# Altium schematic sheet ISO.SchDoc
size A4; SheetNumber: 4; SheetTotal: 6
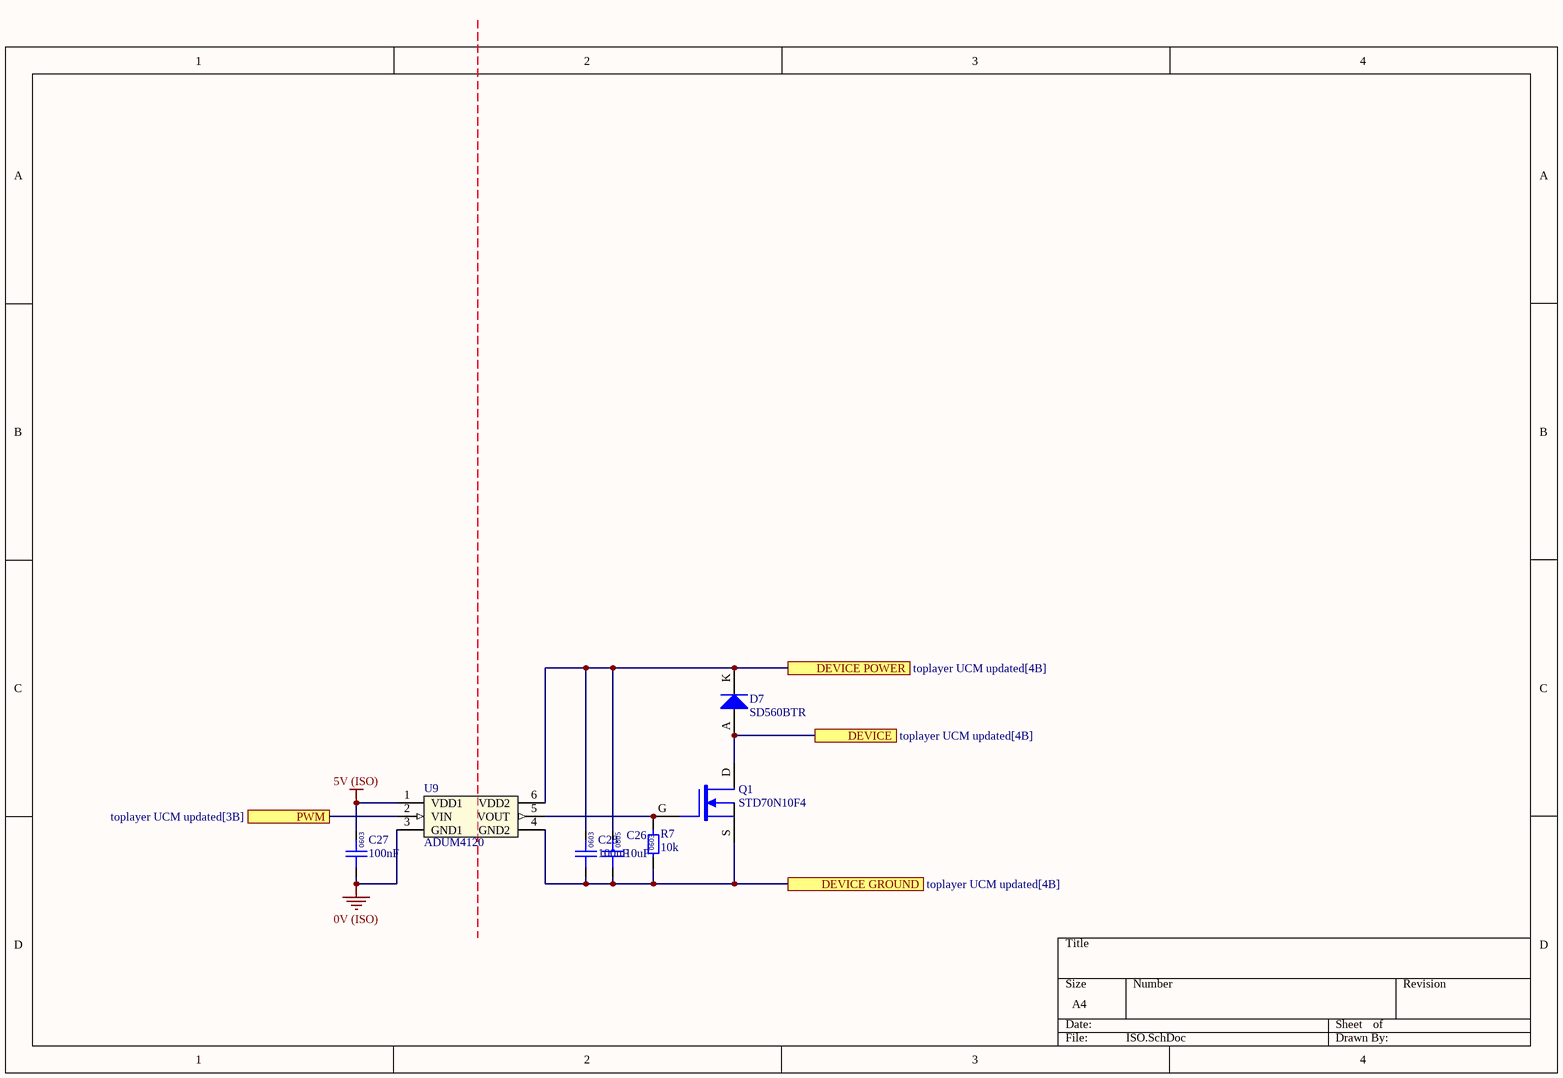
[diagram p0: ISO.SchDoc]

## Parts
C26  10uF  [0805]
C27  100nF  [0603]
C28  100nF  [0603]
D7  SD560BTR  [SMB Diode]
Q1  STD70N10F4  [STM TO-252 MOSFET]
R7  10k  [0603]
U9  ADUM4120  [AD 6-SOIC]

## Ports
DEVICE (see toplayer UCM updated[4B]), DEVICE GROUND (see toplayer UCM updated[4B]), DEVICE POWER (see toplayer UCM updated[4B]), PWM (see toplayer UCM updated[3B])

## Nets
0V (ISO): C27.1 U9.3(GND1)
5V (ISO): C27.2 U9.1(VDD1)
DEVICE: D7.A Q1.D ; port DEVICE
DEVICE GROUND: C26.1 C28.1 Q1.S R7.1 U9.4(GND2) ; port DEVICE GROUND
DEVICE POWER: C26.2 C28.2 D7.K U9.6(VDD2) ; port DEVICE POWER
PWM: U9.2(VIN) ; port PWM
NetQ1_G: Q1.G R7.2 U9.5(VOUT)

## Notes on the sheet
- (in symbol GCM188L81H104KA57D) 0603
- (in symbol GRM21BR6YA106KE43L) 0805
- (in symbol RC0603FR-0710KL) 0603

## Library data of the parts
C26 = GRM21BR6YA106KE43L: Manufacturer: muRata; Rated Voltage: 50V; Tolerance: 10%; Material: MLCC; Temperature Rating: X5R; Part Number: GRM21BR6YA106KE43L; Value: 10uF; Digikey Part Number: 490-10514-6-ND
C27 C28 = GCM188L81H104KA57D: Manufacturer: muRata; Rated Voltage: 50V; Tolerance: ±10%; Material: MLCC; Temperature Rating: X8L; Part Number: GCM188L81H104KA57D; Value: 100nF; Digikey Part Number: 490-6049-1-ND
D7 = SD560BTR: 1.2V_F 600V 5A SMB; Manufacturer: SMC Diode Solutions; Part Number: SD560BTR; Digikey Part Number: 1655-1530-2-ND; Digikey Link: https://www.digikey.com/product-detail/en/smc-diode-solutions/SD560BTR/1655-1530-2-ND/6022620
Q1 = STD70N10F4: N-Channel 100V 60A (Tc) 125W (Tc) Surface Mount DPAK; Manufacturer: STMicroelectronics; Published: 24-Mar-1999; LatestRevisionDate: 29-May-2009; LatestRevisionNote: IPC-7351 Footprint Added.; PackageVersion: Sep-2000; PackageReference: SOT-343; Publisher: Altium Limited; PackageDescription: 4-Pin SOT-343 Package 1.3 mm Pitch, 2.1 mm Lead Span; Part Number: STD70N10F4; Digikey Part Number: 497-8806-2-ND; Digikey Link: https://www.digikey.com/product-detail/en/stmicroelectronics/STD70N10F4/497-8806-2-ND/2035599
R7 = RC0603FR-0710KL: Manufacturer: YAGEO; Tolerance: 0.01; Rated Power: 0.1W; Part Number: RC0603FR-0710KL; Value: 10k; Material: FR-07; Digikey Part Number: 311-10.0KHRCT-ND
U9 = ADUM4120: DGTL ISO 5KV 1CH GATE DRVR 6SOIC; Manufacturer: Analogue Devices; Part Number: ADUM4120; Digikey Part Number: ADUM4120-1ARIZ-ND; Digikey Link: https://www.digikey.com/product-detail/en/analog-devices-inc/ADUM4120-1ARIZ/ADUM4120-1ARIZ-ND/7324273